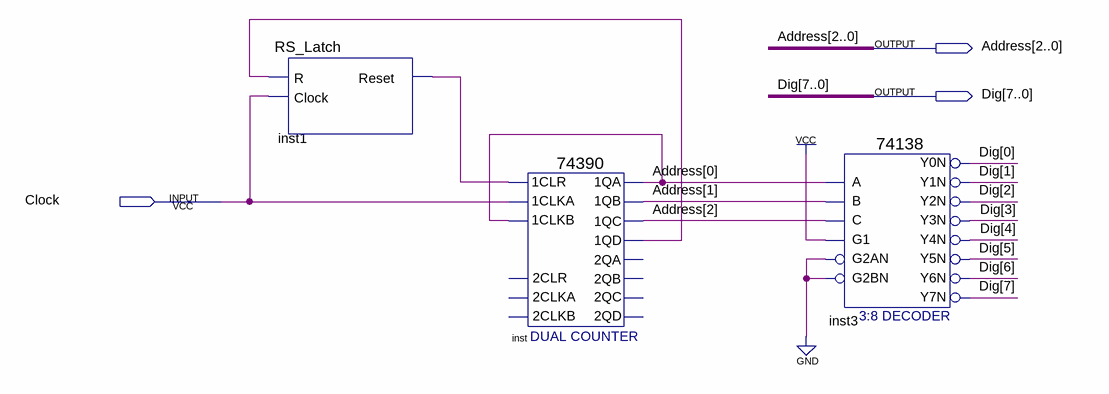
[diagram p0: schematic sheet]
// Quartus schematic Bit_Selective_Signal_Generator.bdf as structural Verilog: 3 symbols, 3 pins
module Bit_Selective_Signal_Generator (
  input  Clock,
  output [2:0] Address,
  output [7:0] Dig
);

  wire inst1_reset, inst_1qd;

  RS_Latch inst1 (.R(inst_1qd), .Clock(Clock), .Reset(inst1_reset));
  \74390  inst (
    .\1CLR (inst1_reset), .\1CLKA (Clock), .\1CLKB (Address[0]), .\1QA (Address[0]), .\1QB (Address[1]),
    .\1QC (Address[2]), .\1QD (inst_1qd));  // open: 2CLKA, 2CLR, 2CLKB, 2QA, 2QB, 2QC, 2QD
  \74138  inst3 (
    .A(Address[0]), .B(Address[1]), .G1(1'b1), .C(Address[2]), .G2AN(1'b0), .G2BN(1'b0), .Y0N(Dig[0]),
    .Y1N(Dig[1]), .Y2N(Dig[2]), .Y3N(Dig[3]), .Y4N(Dig[4]), .Y5N(Dig[5]), .Y6N(Dig[6]), .Y7N(Dig[7]));
endmodule
